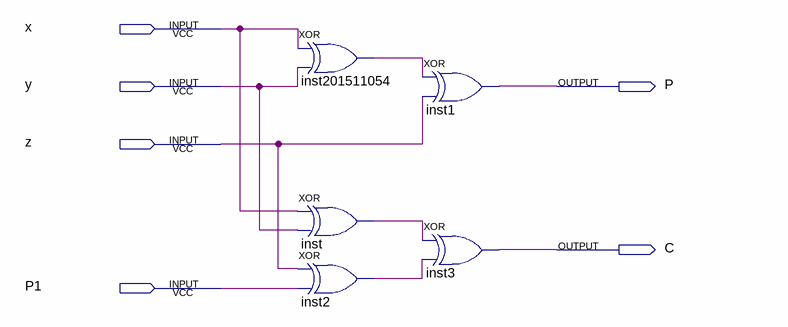
[diagram p0: schematic sheet]
// Quartus schematic lab02_2.bdf as structural Verilog: 5 symbols, 6 pins
module lab02_2 (
  input  x,
  input  y,
  input  z,
  input  P1,
  output P,
  output C
);

  wire inst2_out, inst201511054_out, inst_out;

  xor inst201511054 (inst201511054_out, x, y);
  xor inst (inst_out, x, y);
  xor inst2 (inst2_out, z, P1);
  xor inst1 (P, inst201511054_out, z);
  xor inst3 (C, inst_out, inst2_out);
endmodule
